# Altium schematic sheet 01-PCIe.SchDoc
size Tabloid; Customer: 01910; SheetNumber: 1; SheetTotal: 22
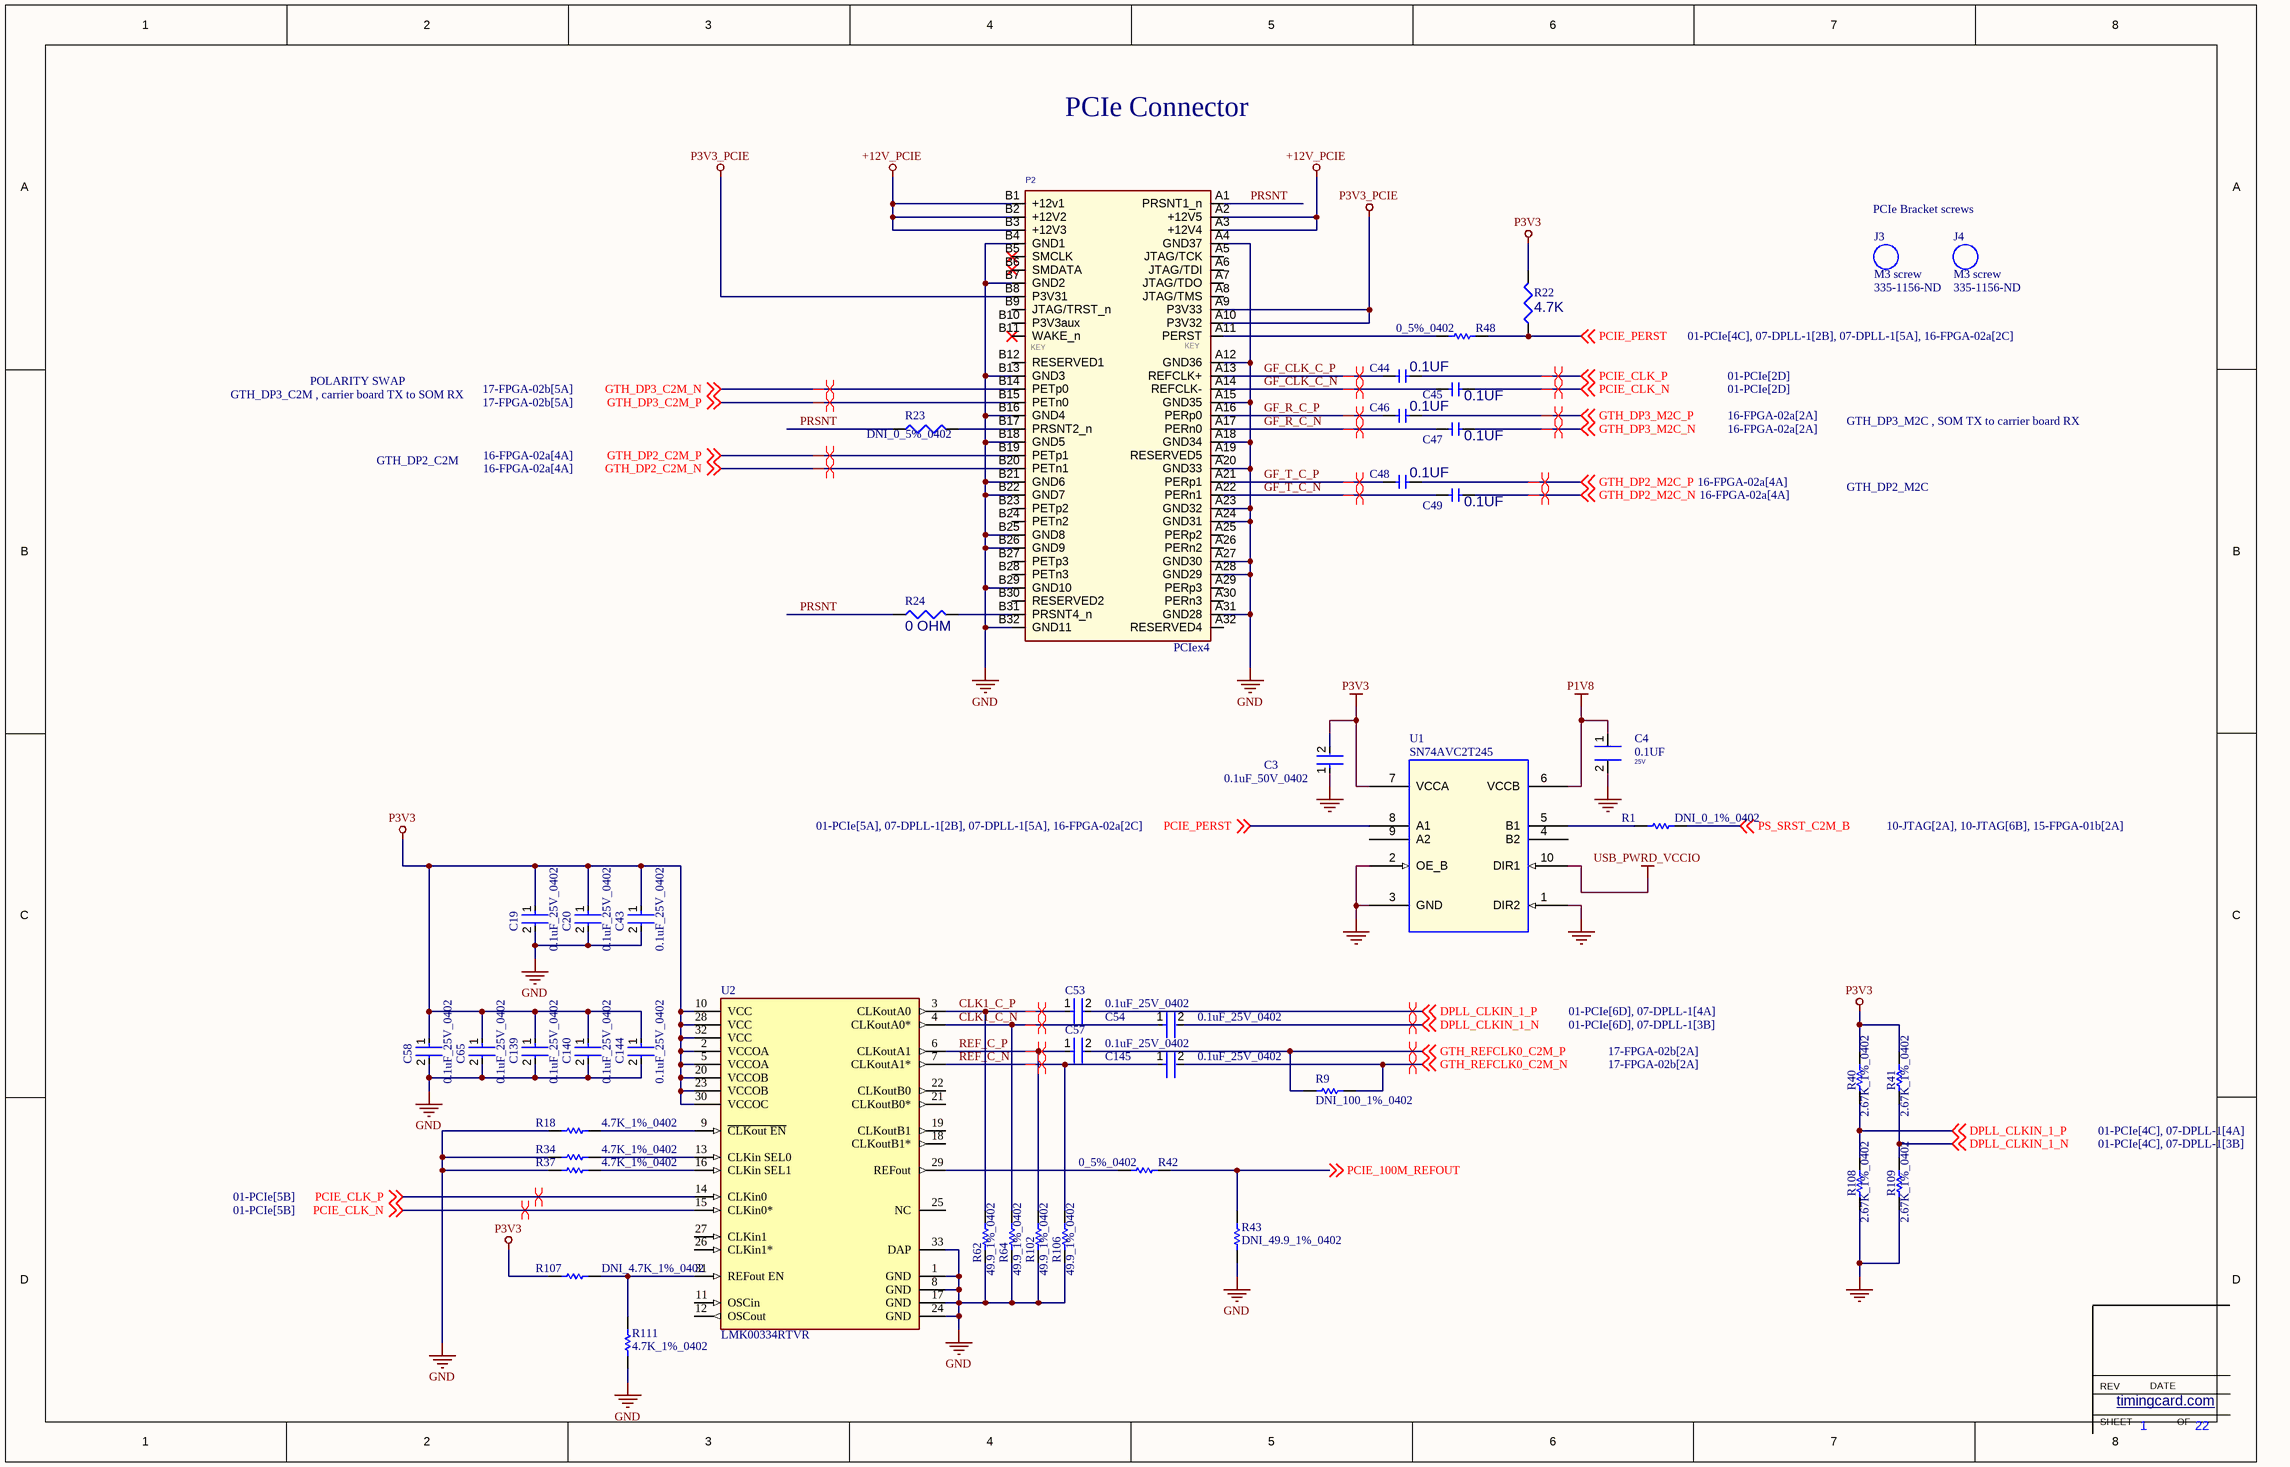
[diagram p0: 01-PCIe.SchDoc]

## Parts
C3  0.1uF_50V_0402  [FP-C1005-050-0_05-IPC_C]
C4  0.1UF  Voltage: 25V  [CAPC100X50X55]
C19  0.1uF_25V_0402  [FP-0402-L_1_0_1-W_0_5_0_1-IPC_C]
C20  0.1uF_25V_0402  [FP-0402-L_1_0_1-W_0_5_0_1-IPC_C]
C43  0.1uF_25V_0402  [FP-0402-L_1_0_1-W_0_5_0_1-IPC_C]
C44  value 0.1UF  [CAPC1005X06N]  (hidden comment: CAP_0402_0.1UF_50V)
C45  value 0.1UF  [CAPC1005X06N]  (hidden comment: CAP_0402_0.1UF_50V)
C46  value 0.1UF  [CAPC1005X06N]  (hidden comment: CAP_0402_0.1UF_50V)
C47  value 0.1UF  [CAPC1005X06N]  (hidden comment: CAP_0402_0.1UF_50V)
C48  value 0.1UF  [CAPC1005X06N]  (hidden comment: CAP_0402_0.1UF_50V)
C49  value 0.1UF  [CAPC1005X06N]  (hidden comment: CAP_0402_0.1UF_50V)
C53  0.1uF_25V_0402  [FP-0402-L_1_0_1-W_0_5_0_1-IPC_C]
C54  0.1uF_25V_0402  [FP-0402-L_1_0_1-W_0_5_0_1-IPC_C]
C57  0.1uF_25V_0402  [FP-0402-L_1_0_1-W_0_5_0_1-IPC_C]
C58  0.1uF_25V_0402  [FP-0402-L_1_0_1-W_0_5_0_1-IPC_C]
C65  0.1uF_25V_0402  [FP-0402-L_1_0_1-W_0_5_0_1-IPC_C]
C139  0.1uF_25V_0402  [FP-0402-L_1_0_1-W_0_5_0_1-IPC_C]
C140  0.1uF_25V_0402  [FP-0402-L_1_0_1-W_0_5_0_1-IPC_C]
C144  0.1uF_25V_0402  [FP-0402-L_1_0_1-W_0_5_0_1-IPC_C]
C145  0.1uF_25V_0402  [FP-0402-L_1_0_1-W_0_5_0_1-IPC_C]
J3  M3 screw  Supplier Part Number 1: 335-1156-ND
J4  M3 screw  Supplier Part Number 1: 335-1156-ND
P2  PCIex4  [PCIE_4LANE_EDGE]
R1  DNI_0_1%_0402  [RESC1005X40X25LL05T05]  (no BOM)
R9  DNI_100_1%_0402  [RESC1005X40X25ML05T10]  (no BOM)
R18  4.7K_1%_0402  [RESC1005X40X25NL10T10]
R22  value 4.7K  [RESC1608X50N]  (hidden comment: ERJ-3EKF4701V)
R23  DNI_0_5%_0402  [RESC1005X04N]  (no BOM)
R24  value 0 OHM  [RESC1005X04N]  (hidden comment: ERJ-2GE0R00X)
R34  4.7K_1%_0402  [RESC1005X40X25NL10T10]
R37  4.7K_1%_0402  [RESC1005X40X25NL10T10]
R40  2.67K_1%_0402  [RESC1005X40X25NL05T10]
R41  2.67K_1%_0402  [RESC1005X40X25NL05T10]
R42  0_5%_0402  [RESC1005X40X25LL10T10]
R43  DNI_49.9_1%_0402  [RESC1005X40X25NL10T10]  (no BOM)
R48  0_5%_0402  [RESC1005X40X25LL10T10]
R62  49.9_1%_0402  [RESC1005X40X25NL10T10]
R64  49.9_1%_0402  [RESC1005X40X25NL10T10]
R102  49.9_1%_0402  [RESC1005X40X25NL10T10]
R106  49.9_1%_0402  [RESC1005X40X25NL10T10]
R107  DNI_4.7K_1%_0402  [RESC1005X40X25NL10T10]  (no BOM)
R108  2.67K_1%_0402  [RESC1005X40X25NL05T10]
R109  2.67K_1%_0402  [RESC1005X40X25NL05T10]
R111  4.7K_1%_0402  [RESC1005X40X25NL10T10]
U1  SN74AVC2T245  [QFN40P140X180X55-10]
U2  LMK00334RTVR  [FP-RTV0032A-MFG]

## Nets
+12V_PCIE: P2.A2(+12V5) P2.A3(+12V4) P2.B1(+12v1) P2.B2(+12V2) P2.B3(+12V3)
GND: C3.1 C4.2 C19.2 C20.2 C43.2 C58.2 C65.2 C139.2 C140.2 C144.2 P2.A4(GND37) P2.A12(GND36) P2.A15(GND35) P2.A18(GND34) P2.A20(GND33) P2.A23(GND32) P2.A24(GND31) P2.A27(GND30) P2.A28(GND29) P2.A31(GND28) P2.B4(GND1) P2.B7(GND2) P2.B13(GND3) P2.B16(GND4) P2.B18(GND5) P2.B21(GND6) P2.B22(GND7) P2.B25(GND8) P2.B26(GND9) P2.B29(GND10) P2.B32(GND11) R18.2 R34.2 R37.2 R43.2 R62.1 R64.1 R102.1 R106.1 R108.1 R109.1 R111.2 U1.1(DIR2) U1.2(OE_B) U1.3(GND) U2.1(GND) U2.8(GND) U2.17(GND) U2.24(GND) U2.33(DAP)
P1V8: C4.1 U1.6(VCCB)
P3V3: C3.2 C19.1 C20.1 C43.1 C58.1 C65.1 C139.1 C140.1 C144.1 R22.2 R40.2 R41.2 R107.2 U1.7(VCCA) U2.2(VCCOA) U2.5(VCCOA) U2.10(VCC) U2.20(VCCOB) U2.23(VCCOB) U2.28(VCC) U2.30(VCCOC) U2.32(VCC)
P3V3_PCIE: P2.A9(P3V33) P2.A10(P3V32) P2.B8(P3V31)
USB_PWRD_VCCIO: U1.10(DIR1)
CLK1_C_N: C54.1 R64.2 U2.4(CLKoutA0*)
CLK1_C_P: C53.1 R62.2 U2.3(CLKoutA0)
DPLL_CLKIN_1_N: C54.2 R41.1 R109.2 ; off-sheet DPLL_CLKIN_1_N
DPLL_CLKIN_1_P: C53.2 R40.1 R108.2 ; off-sheet DPLL_CLKIN_1_P
GF_CLK_C_N: C45.1 P2.A14(REFCLK-)
GF_CLK_C_P: C44.1 P2.A13(REFCLK+)
GF_R_C_N: C47.1 P2.A17(PERn0)
GF_R_C_P: C46.1 P2.A16(PERp0)
GF_T_C_N: C49.1 P2.A22(PERn1)
GF_T_C_P: C48.1 P2.A21(PERp1)
GTH_DP2_C2M_N: P2.B20(PETn1) ; off-sheet GTH_DP2_C2M_N
GTH_DP2_C2M_P: P2.B19(PETp1) ; off-sheet GTH_DP2_C2M_P
GTH_DP2_M2C_N: C49.2 ; off-sheet GTH_DP2_M2C_N
GTH_DP2_M2C_P: C48.2 ; off-sheet GTH_DP2_M2C_P
GTH_DP3_C2M_N: P2.B14(PETp0) ; off-sheet GTH_DP3_C2M_N
GTH_DP3_C2M_P: P2.B15(PETn0) ; off-sheet GTH_DP3_C2M_P
GTH_DP3_M2C_N: C47.2 ; off-sheet GTH_DP3_M2C_N
GTH_DP3_M2C_P: C46.2 ; off-sheet GTH_DP3_M2C_P
GTH_REFCLK0_C2M_N: C145.2 R9.2 ; off-sheet GTH_REFCLK0_C2M_N
GTH_REFCLK0_C2M_P: C57.2 R9.1 ; off-sheet GTH_REFCLK0_C2M_P
PCIE_100M_REFOUT: R42.2 R43.1 ; off-sheet PCIE_100M_REFOUT
PCIE_CLK_N: C45.2 U2.15(CLKin0*) ; off-sheet PCIE_CLK_N
PCIE_CLK_P: C44.2 U2.14(CLKin0) ; off-sheet PCIE_CLK_P
PCIE_PERST: R22.1 R48.2 U1.8(A1) ; off-sheet PCIE_PERST
PRSNT: P2.A1(PRSNT1_n) R23.1 R24.1
PS_SRST_C2M_B: R1.2 ; off-sheet PS_SRST_C2M_B
REF_C_N: C145.1 R106.2 U2.7(CLKoutA1*)
REF_C_P: C57.1 R102.2 U2.6(CLKoutA1)
NetP2_A11: P2.A11(PERST) R48.1
NetP2_B17: P2.B17(PRSNT2_n) R23.2
NetP2_B31: P2.B31(PRSNT4_n) R24.2
NetR1_1: R1.1 U1.5(B1)
NetR18_1: R18.1 U2.9(~{CLKout_EN})
NetR34_1: R34.1 U2.13(CLKin_SEL0)
NetR37_1: R37.1 U2.16(CLKin_SEL1)
NetR42_1: R42.1 U2.29(REFout)
NetR107_1: R107.1 R111.1 U2.31(REFout_EN)

Not connected (* = marked no-connect by the designer): P2 A5(JTAG/TCK) A6(JTAG/TDI) A7(JTAG/TDO) A8(JTAG/TMS) A19(RESERVED5) A25(PERp2) A26(PERn2) A29(PERp3) A30(PERn3) A32(RESERVED4) B5(SMCLK)* B6(SMDATA)* B9(JTAG/TRST_n) B10(P3V3aux) B11(WAKE_n)* B12(RESERVED1) B23(PETp2) B24(PETn2) B27(PETp3) B28(PETn3) B30(RESERVED2); U1 4(B2) 9(A2); U2 11(OSCin) 12(OSCout) 18(CLKoutB1*) 19(CLKoutB1) 21(CLKoutB0*) 22(CLKoutB0) 25(NC) 26(CLKin1*) 27(CLKin1)

## Layout directives
differential pair: CLK1_C_N, CLK1_C_P, DPLL_CLKIN_1_N, DPLL_CLKIN_1_P, GF_CLK_C_N, GF_CLK_C_P, GF_R_C_N, GF_R_C_P, GF_T_C_N, GF_T_C_P, GTH_DP2_C2M_N, GTH_DP2_C2M_P, GTH_DP2_M2C_N, GTH_DP2_M2C_P, GTH_DP3_C2M_N, GTH_DP3_C2M_P, GTH_DP3_M2C_N, GTH_DP3_M2C_P, GTH_REFCLK0_C2M_N, GTH_REFCLK0_C2M_P, PCIE_CLK_N, PCIE_CLK_P, REF_C_N, REF_C_P

## Notes on the sheet
- PCIe Connector
- PCIe Bracket screws
- GTH_DP3_C2M , carrier board TX to SOM RX
- POLARITY SWAP
- GTH_DP3_M2C , SOM TX to carrier board RX
- GTH_DP2_C2M
- GTH_DP2_M2C
- SHEET
- REV
- timingcard.com <http://timingcard.com>
- DATE
- OF
- (in symbol PCIex4) KEY

## Library data of the parts
C3 = CMP-2000-05393-2: Multilayer Ceramic Capacitors 100nF ±10% 50V X7R SMD 0402; Voltage: 50V; Dielectric Material: Ceramic; Min Operating Temperature: -55°C; Depth: 0.5mm; Radiation Hardening: No; RoHS Compliant: Yes; Voltage Rating (DC): 50V; Lead Free: Lead Free; Resistor Type: Ceramic; Height: 0.5mm; Dielectric: X7R; Thickness: 0.022inch; Case/Package: 0402; Case Code (Metric): 1005; Termination: SMD/SMT; Capacitance: 100nF; Packaging: Tape and Reel; Max Operating Temperature: 125°C; Mount: Surface Mount; Package Quantity: 1; Width: 0.02inch; Weight: 2.3E-05oz; Voltage Rating: 50V; Tolerance: 10%; Construction: Flat; Case Code (Imperial): 0402; Length: 1mm; REACH SVHC: No SVHC; Series: C
C4 = CAP_NP: Cap Cer 100nF 10% 25V X5R 0402; Manufacturer PN: TMK105BJ104KV-F; Manufacturer: TAIYO YUDEN; Agile Part Number: CAP-00068-01; barcode: 100040; OWNER: 4001; ALT_SYMBOLS: CAPC100X50X55RND; PCB Footprint: CAPC100X50X55; PartType: CERAMIC; ROHS: Yes; PRICE: 0.01; Part Type: CERAMIC; Dielectric Type: X5R; CIP Link: http://xsjbrdwin1/CIP-E/Component/Index/All?pn=100040; Tolerance: 10%
C19 C20 C43 C53 C54 C57 C58 C65 C139 C140 C144 C145 = CMP-2008-02519-2: General Purpose Ceramic Capacitor, 0402, 100nF, 10%, X7R, 15%, 25V; Package Quantity: 1; Capacitance: 100nF; Min Operating Temperature: -55°C; Voltage: 25V; Voltage Rating: 25V; Construction: Flat; Max Operating Temperature: 125°C; Radiation Hardening: No; Depth: 0.5mm; Thickness: 0.022inch; Voltage Rating (DC): 25V; Number of Pins: 2; Lead Free: Lead Free; Series: -; REACH SVHC: No SVHC; Length: 1mm; Dielectric: X7R; RoHS Compliant: Yes; Mount: Surface Mount; Packaging: Tape and Reel; Case/Package: 0402; Case Code (Imperial): 0402; Termination: SMD/SMT; Width: 0.02inch; Case Code (Metric): 1005; Tolerance: 10%
C44-C49 = CAP_0402_0.1UF_50V: CAP, CER, 0.1UF, 50V, 10%, X7R, AEC-Q200, 0402; MFG PART NUM: CGA2B3X7R1H104K050BB; VALENTIUM PART NUM: <VALENTIUM>; MFG NAME: TDK; MAXTEMP: 125C; MINTEMP: -55C; CATEGORY: CAP, CER; MODIFY DATE: 10/23/2013; SHEETPART: *; P1: 10%; OTHER: AEC-Q200; P2: 50V; P3: X7R; Size: 0402; DESC: CAP, CER, 0.1UF, 50V, 10%, X7R, AEC-Q200, 0402; Supplier 1: Digi-Key; Supplier Part Number 1: 445-6899-1-ND
P2 = PCIex4: PCIE x4 Edge Connector,OrCAD Symbol,NC; Part Number: 451; Manufacturer: NA; NOTE: NC; Vendor P/N: NA; Part Type: SMT
R1 = CMP-2000-07451-1: Chip Resistor, 0 Ohm, 0.1 W, -55 to 155 degC, 0402 (1005 Metric), RoHS, Tape and Reel; Manufacturer: Panasonic; Voltage Rating (DC): 50V; Temperature Coefficient: 600ppm/��C; Max Power Dissipation: 100mW; Resistance: 0mOhm; Tolerance: 5%; Number of Terminations: 2; Mount: SurfaceMount; Height: 0.35mm; Packaging: TapeandReel; Contact Plating: Tin; Manufacturer URL: http://www.panasonic.com/; Composition: ThickFilm; Max Operating Temperature: 155degC; REACH SVHC: NoSVHC; Case/Package: 0402; Package Reference: 402; Depth: 0.5mm; Package Description: 2-Pin Surface Mount Device, Body 1 x 0.5 mm; Datasheet URL: https://industrial.panasonic.com/cdbs/www-data/pdf/RDA0000/AOA0000C301.pdf; RoHSCompliant: True; Case Code (Imperial): 0402; Military Standard: Not; Min Operating Temperature: -55degC; Power Rating: 100mW; Datasheet Version: 03/2015; Length: 1mm; Case Code (Metric): 1005; Termination: SMD/SMT; Mounting Technology: SurfaceMount; Voltage Rating: 50V; Width: 0.02inch; Package Quantity: 1; Lead Free: LeadFree; Radiation Hardening: No
R9 = CMP-2002-06458-1: Part Number: ERJ-U02F1000X; Manufacturer: Panasonic
R18 R34 R37 R107 R111 = CMP-2002-05217-1: Manufacturer: Bourns; Part Number: CR0402-FX-4701GLF
R22 = RES_0603_4.7K: RES, 4.7K, 1%, 1/10W, TF, 0603; VELENTIUM PART NUM: <VELENTIUM>; MFG NAME: PANASONIC; MAXTEMP: 125C; MINTEMP: -55C; OTHER: 100PPM; SUB: GENERIC; ModifyDate: 7/25/2013; MFG PART NUM: ERJ-3EKF4701V; CATEGORY: RES; Date: 7/26/2013; P1: 1%; P3: TF; P2: 1/10W; SIZE: 0603; Supplier 1: Digi-Key; Supplier Part Number 1: P4.70KHCT-ND; SHEETPART: *; DESC: RES, 4.7K, 1%, 1/10W, TF, 0603
R23 = RES_0402_0: RES, 0. OHM, 1%, 1/16W, TF, AEC-Q200, 0402; MFG PART NUM: ERJ-2GE0R00X; VELENTIUM PART NUM: <VELENTIUM>; MFG NAME: PANASONIC; MAXTEMP: 155C; MINTEMP: -55C; OTHER: 100PPM, AEC-Q200; SUB: GENERIC; DESC: RES, 0 OHM, 1%, 1/16W, TF, AEC-Q200, 0402; VALUE: 0 OHM; ModifyDate: 7/25/2013; CATEGORY: RES; Date: 7/26/2013; P1: 1%; P3: TF; P2: 1/16W; SIZE: 0402; SHEETPART: *; Supplier 1: Digi-Key; Supplier Part Number 1: P0.0JCT-ND
R24 = RES_0402_0: RES, 0. OHM, 1%, 1/16W, TF, AEC-Q200, 0402; VELENTIUM PART NUM: <VELENTIUM>; MFG NAME: PANASONIC; MAXTEMP: 155C; MINTEMP: -55C; OTHER: 100PPM, AEC-Q200; SUB: GENERIC; DESC: RES, 0 OHM, 1%, 1/16W, TF, AEC-Q200, 0402; ModifyDate: 7/25/2013; MFG PART NUM: ERJ-2GE0R00X; CATEGORY: RES; Date: 7/26/2013; P1: 1%; P3: TF; P2: 1/16W; SIZE: 0402; SHEETPART: *; Supplier 1: Digi-Key; Supplier Part Number 1: P0.0JCT-ND
R40 R41 R108 R109 = CMP-2002-07574-1: Manufacturer: Yageo; Part Number: RC0402FR-072K67L
R42 R48 = CMP-2002-04569-1: Manufacturer: KOA Speer; Part Number: RK73Z1ETTP
R43 R62 R64 R102 R106 = CMP-2002-04448-1: Part Number: RK73H1ETTP49R9F; Manufacturer: KOA Speer
U1 = SN74AVC2T245: IC Lvl Trans 2-Bit Bidir 500Mbps 1.2-3.6V 50mA UQFN-10; Manufacturer PN: SN74AVC2T245RSWR; Manufacturer: TEXAS INSTRUMENTS; Agile Part Number: ICS-00048-01; EDMVersionID: 493023062; Barcode: 500012; PCB Footprint: QFN40P140X180X55-10; Part Type: BUS TRANSCEIVER; CIP Link: http://xsjbrdwin1/CIP-E/Component/Index/All?pn=500012
U2 = CMP-04855-000011-1: IC CLK BUF 400MHZ 1CIRC 32WQFN; Number of Outputs: 4; Max Supply Voltage: 3.45V; PLL: No; Max Duty Cycle: 55%; Operating Supply Current: 13.5mA; Min Supply Voltage: 3.15V; Nominal Supply Current: 8.5mA; Input: Crystal; Propagation Delay: 2700ps; Operating Supply Voltage: 3.3V; Number of Circuits: 1; REACH SVHC: No SVHC; Radiation Hardening: No; RoHS Compliant: Yes; Lead Free: Lead Free; Mount: Surface Mount; Min Operating Temperature: -40°C; Package Quantity: 1000; Max Operating Temperature: 85°C; Number of Pins: 32; Max Frequency: 400MHz; Frequency: 400MHz; Packaging: Tape and Reel
J3 J4 = M3 screw: Supplier 1: Digi-Key